# EAGLE design Pontos Cegos - Rev A (EAGLE 7.3.0)
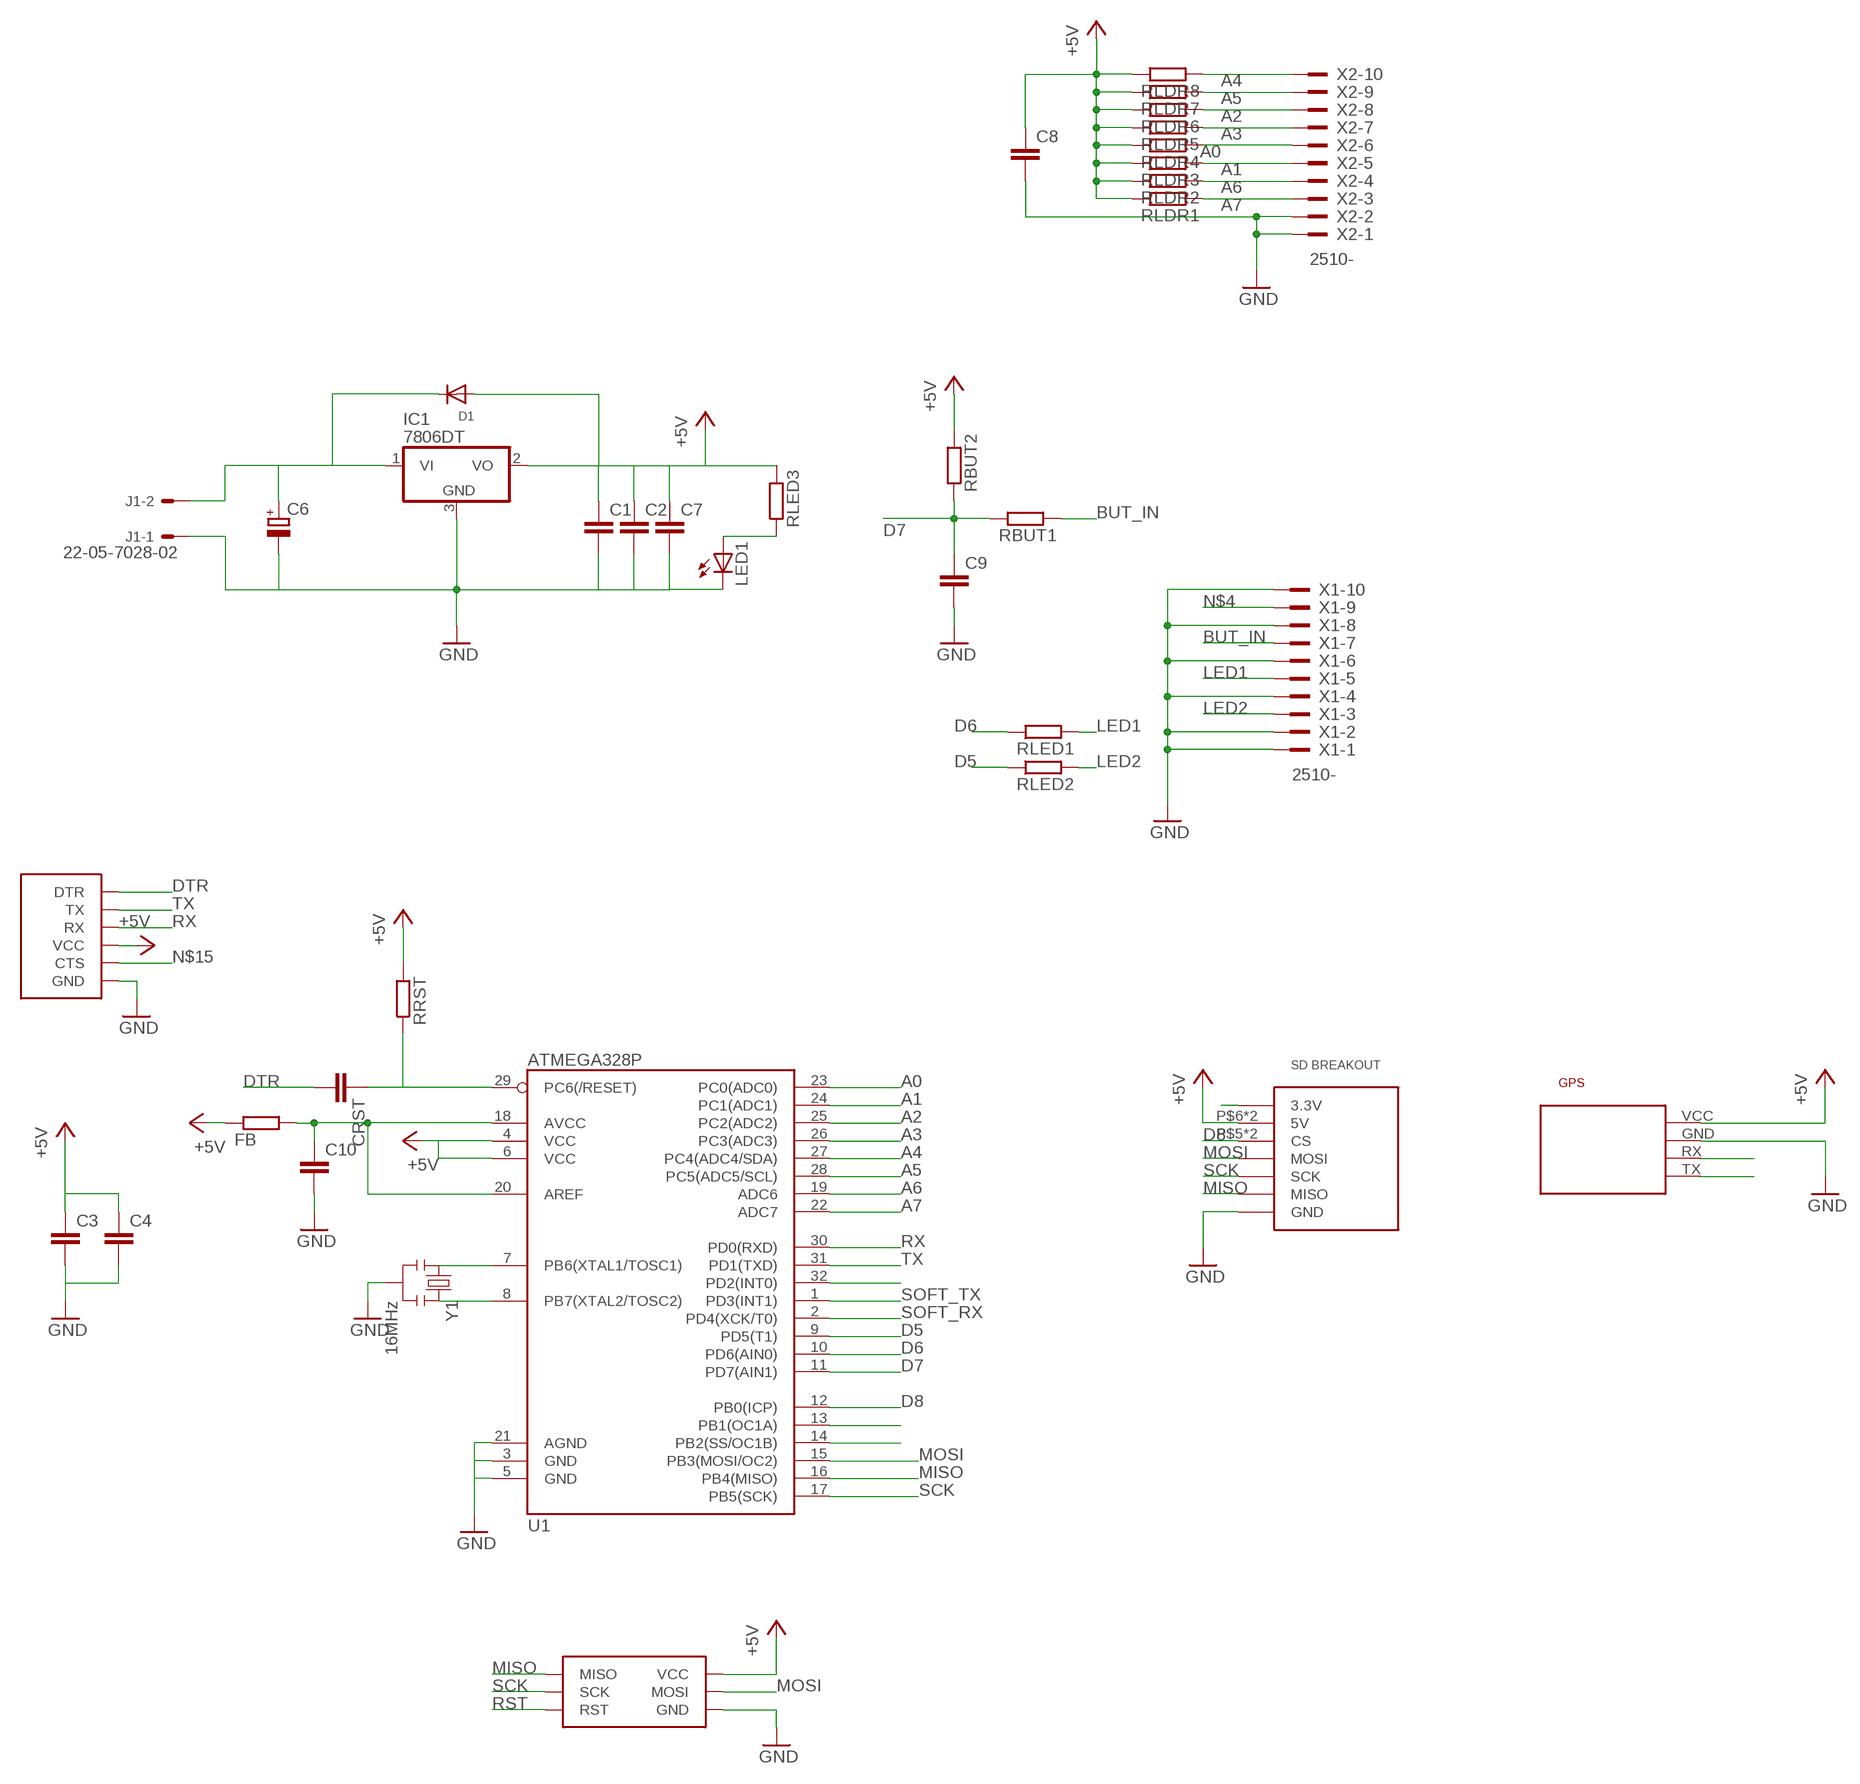
[diagram p0: schematic, sheet 1]

## Parts
C1  C-EUC1210  [C1210]
C2  C-EUC1210  [C1210]
C3  C-EUC0603  [C0603]
C4  C-EUC0603  [C0603]
C6  CPOL-EUD  [PANASONIC_D]
C7  C-EUC1210  [C1210]
C8  C-EUC0805  [C0805]
C9  C-EUC0805  [C0805]
C10  C-EUC0603  [C0603]
CRST  C-EUC0603  [C0603]
D1  DIODESMA  [SMADIODE]
FB  R-EU_R0603  [R0603]
IC1  7806DT  [TO252]
J1  22-05-7028-02  [7395-02]
LED1  LED5MM  [LED5MM]
RBUT1  R-EU_R0603  [R0603]
RBUT2  R-EU_R0603  [R0603]
RLDR1  R-EU_R0603  [R0603]
RLDR2  R-EU_R0603  [R0603]
RLDR3  R-EU_R0603  [R0603]
RLDR4  R-EU_R0603  [R0603]
RLDR5  R-EU_R0603  [R0603]
RLDR6  R-EU_R0603  [R0603]
RLDR7  R-EU_R0603  [R0603]
RLDR8  R-EU_R0603  [R0603]
RLED1  R-EU_R0603  [R0603]
RLED2  R-EU_R0603  [R0603]
RLED3  R-EU_R0603  [R0603]
RRST  R-EU_R0603  [R0603]
U1  ATMEGA328P  ATMEGA328_SMT  [TQFP32-08]
U$1  ISP_POGOISP_POGO  [ISP_POGO]
U$2  SD_BREAKOUT  [SD_BREAKOUT]
U$3  NEO6M_BREAKOUT  [NEO6M_BREAKOUT]
U$4  FTDI_HEADERSMD  [FTDI_HEADER_SMD]
X1  2510-  [PAK100/2500-10]
X2  2510-  [PAK100/2500-10]
Y1  16MHz  RESONATOR16MHZ  [RESONATOR-SMD]

## Nets
+5V: C1.1 C2.1 C3.1 C4.1 C7.1 C8.1 D1.A FB.1 IC1.2(VO) RBUT2.2 RLDR1.1 RLDR2.1 RLDR3.1 RLDR4.1 RLDR5.1 RLDR6.1 RLDR7.1 RLDR8.1 RLED3.2 RRST.2 U1.4(VCC) U1.6(VCC) U$1.VCC U$2.P$6(5V) U$2.P$14(5V) U$3.VCC U$4.VCC
A0: RLDR4.2 U1.23(PC0(ADC0)) X2.6
A1: RLDR3.2 U1.24(PC1(ADC1)) X2.5
A2: RLDR6.2 U1.25(PC2(ADC2)) X2.8
A3: RLDR5.2 U1.26(PC3(ADC3)) X2.7
A4: RLDR8.2 U1.27(PC4(ADC4/SDA)) X2.10
A5: RLDR7.2 U1.28(PC5(ADC5/SCL)) X2.9
A6: RLDR2.2 U1.19(ADC6) X2.4
A7: RLDR1.2 U1.22(ADC7) X2.3
BUT_IN: RBUT1.2 X1.7
D5: RLED2.1 U1.9(PD5(T1))
D6: RLED1.1 U1.10(PD6(AIN0))
D7: C9.1 RBUT1.1 RBUT2.1 U1.11(PD7(AIN1))
D8: U1.12(PB0(ICP)) U$2.P$5(CS) U$2.P$13(CS)
DTR: CRST.2 U$4.DTR
GND: C1.2 C2.2 C3.2 C4.2 C6.- C7.2 C8.2 C9.2 C10.2 IC1.3(GND) J1.1 LED1.K(C) U1.3(GND) U1.5(GND) U1.21(AGND) U$1.GND U$2.P$1(GND) U$2.P$8(GND) U$2.P$9(GND) U$2.P$16(GND) U$3.GND U$4.GND X1.1 X1.2 X1.4 X1.6 X1.8 X1.10 X2.1 X2.2 Y1.2
LED1: RLED1.2 X1.5
LED2: RLED2.2 X1.3
MISO: U1.16(PB4(MISO)) U$1.MISO U$2.P$2(MISO) U$2.P$10(MISO)
MOSI: U1.15(PB3(MOSI/OC2)) U$1.MOSI U$2.P$4(MOSI) U$2.P$12(MOSI)
N$1: U1.7(PB6(XTAL1/TOSC1)) Y1.1
N$2: U1.8(PB7(XTAL2/TOSC2)) Y1.3
N$3: LED1.A RLED3.1
N$4: X1.9
N$10: U1.32(PD2(INT0))
N$13: C6.+ D1.C IC1.1(VI) J1.2
N$15: U$4.CTS
N$19: U1.13(PB1(OC1A))
N$20: U1.14(PB2(SS/OC1B))
N$22: C10.1 FB.2 U1.18(AVCC) U1.20(AREF)
N$25: U$2.P$7(3.3V) U$2.P$15(3.3V)
RST: CRST.1 RRST.1 U1.29(PC6(/RESET)) U$1.RST
RX: U1.30(PD0(RXD)) U$4.RX
SCK: U1.17(PB5(SCK)) U$1.SCK U$2.P$3(SCK) U$2.P$11(SCK)
SOFT_RX: U1.2(PD4(XCK/T0)) U$3.TX
SOFT_TX: U1.1(PD3(INT1)) U$3.RX
TX: U1.31(PD1(TXD)) U$4.TX

## Library data of the parts
C1-C4 C7-C10 CRST = wes:C-EU: CAPACITOR, European symbol
C6 = rcl:CPOL-EU: POLARIZED CAPACITOR, European symbol
D1 = adafruit:DIODE: Diode SMADIODE - SMA Surface Mount Package 20V 1A Schottky Diode Digikey: 641-1014-6-ND DO-1N4148 - Through Hole Small Current Diode SOD-123 20V 1 A (.5mV Vf) Schottky Diode - Digikey: MBRX120TPMSCT-ND SOD-323 10V 570mA (.38mV Vf, 3ns) Schottky Diode - Digikey: ZLLS410CT-ND SOD-523 30V 30mA Schottky Diode (RB751S-40TE61) - Digikey: RB751S-40TE61CT-ND SOT23-R/W - SOT23 Package (R = Solder Paste/Reflow Ovens, W = Hand-Soldering) BAT54Film 40V 300mA - Digikey: 497-7162-1-ND
FB RBUT1 RBUT2 RLDR1-RLDR8 RLED1-RLED3 RRST = wes:R-EU_: RESISTOR, European symbol
IC1 = linear:78*: Positive VOLTAGE REGULATOR Source: http://cache.national.com/ds/LM/LM78L05.pdf http://www.fairchildsemi.com/ds/LM/LM7805.pdf
J1 = con-molex:22-?-02: CONNECTOR wire to board 2.54 mm (.1 inch) pitch header; OC_FARNELL: 9731601; OC_NEWARK: unknown
LED1 = adafruit:LED: LED OSRAM: - CHIPLED LG R971, LG N971, LY N971, LG Q971, LY Q971, LO R971, LY R971 LH N974, LH R974 LS Q976, LO Q976, LY Q976 LO Q996 - Hyper CHIPLED LW Q18S LB Q993, LB Q99A, LB R99A - SideLED LS A670, LO A670, LY A670, LG A670, LP A670 LB A673, LV A673, LT A673, LW A673 LH A674 LY A675 LS A676, LA A676, LO A676, LY A676, LW A676 LS A679, LY A679, LG A679 - Hyper Micro SIDELED® LS Y876, LA Y876, LO Y876, LY Y876 LT Y87S - SmartLED LW L88C, LW L88S LB L89C, LB L89S, LG L890 LS L89K, LO L89K, LY L89K LS L896, LA L896, LO L896, LY L896 - TOPLED LS T670, LO T670, LY T670, LG T670, LP T670 LSG T670, LSP T670, LSY T670, LOP T670, LYG T670 LG T671, LOG T671, LSG T671 LB T673, LV T673, LT T673, LW T673 LH T674 LS T676, LA T676, LO T676, LY T676, LB T676, LH T676, LSB T676, LW T676 LB T67C, LV T67C, LT T67C, LS T67K, LO T67K, LY T67K, LW E67C LS E67B, LA E67B, LO E67B, LY E67B, LB E67C, LV E67C, LT E67C LW T67C LS T679, LY T679, LG T679 LS T770, LO T770, LY T770, LG T770, LP T770 LB T773, LV T773, LT T773, LW T773 LH T774 LS E675, LA E675, LY E675, LS T675 LS T776, LA T776, LO T776, LY T776, LB T776 LHGB T686 LT T68C, LB T68C - Hyper Mini TOPLED® LB M676 - Mini TOPLED Santana® LG M470 LS M47K, LO M47K, LY M47K Source: http://www.osram.convergy.de/
U1 = SparkFun-DigitalIC:ATMEGA328_SMT: 32-Pin Atmega328 part Commonly used on Arduino compatible boards Available in QFP and QFN packages TQFP is IC-09069 QFN is non-stock; PROD_ID: IC-09069
U$1 = wes:ISP_POGO
U$2 = wes:SD_BREAKOUT
U$3 = wes:NEO6M_BREAKOUT
U$4 = wes:FTDI_HEADER
X1 X2 = con-3m:2510-: 3M (TM) Pak 100 4-Wall Header Source: 3M; MF: 3M; MPN: 2510-6002UB; OC_FARNELL: 9838244; OC_NEWARK: 46F4725
Y1 = SparkFun-FreqCtrl:RESONATOR: Resonator Small SMD resonator. Used, eg, on the Arduino Pro/ Pro Mini boards. 8MHz- XTAL-08895 16MHz- XTAL-08900; PROD_ID: XTAL-08900

## Board
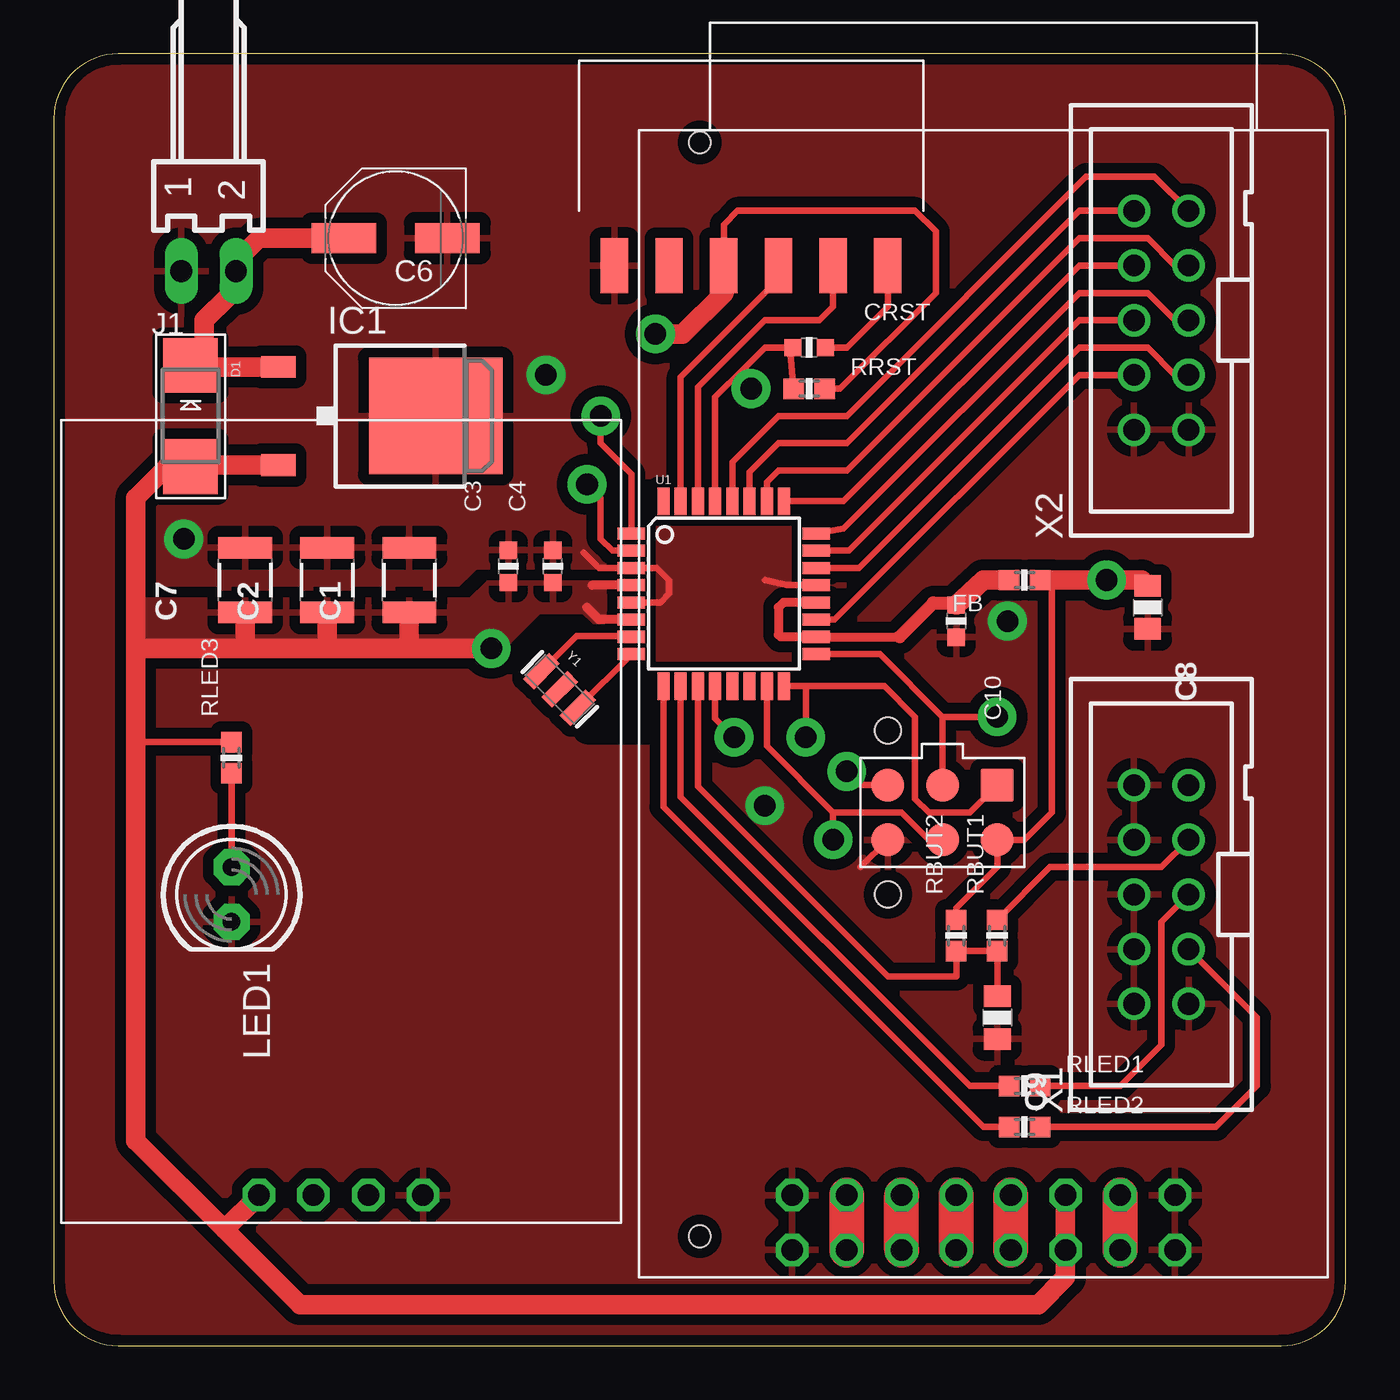
[diagram p1: board, top side]
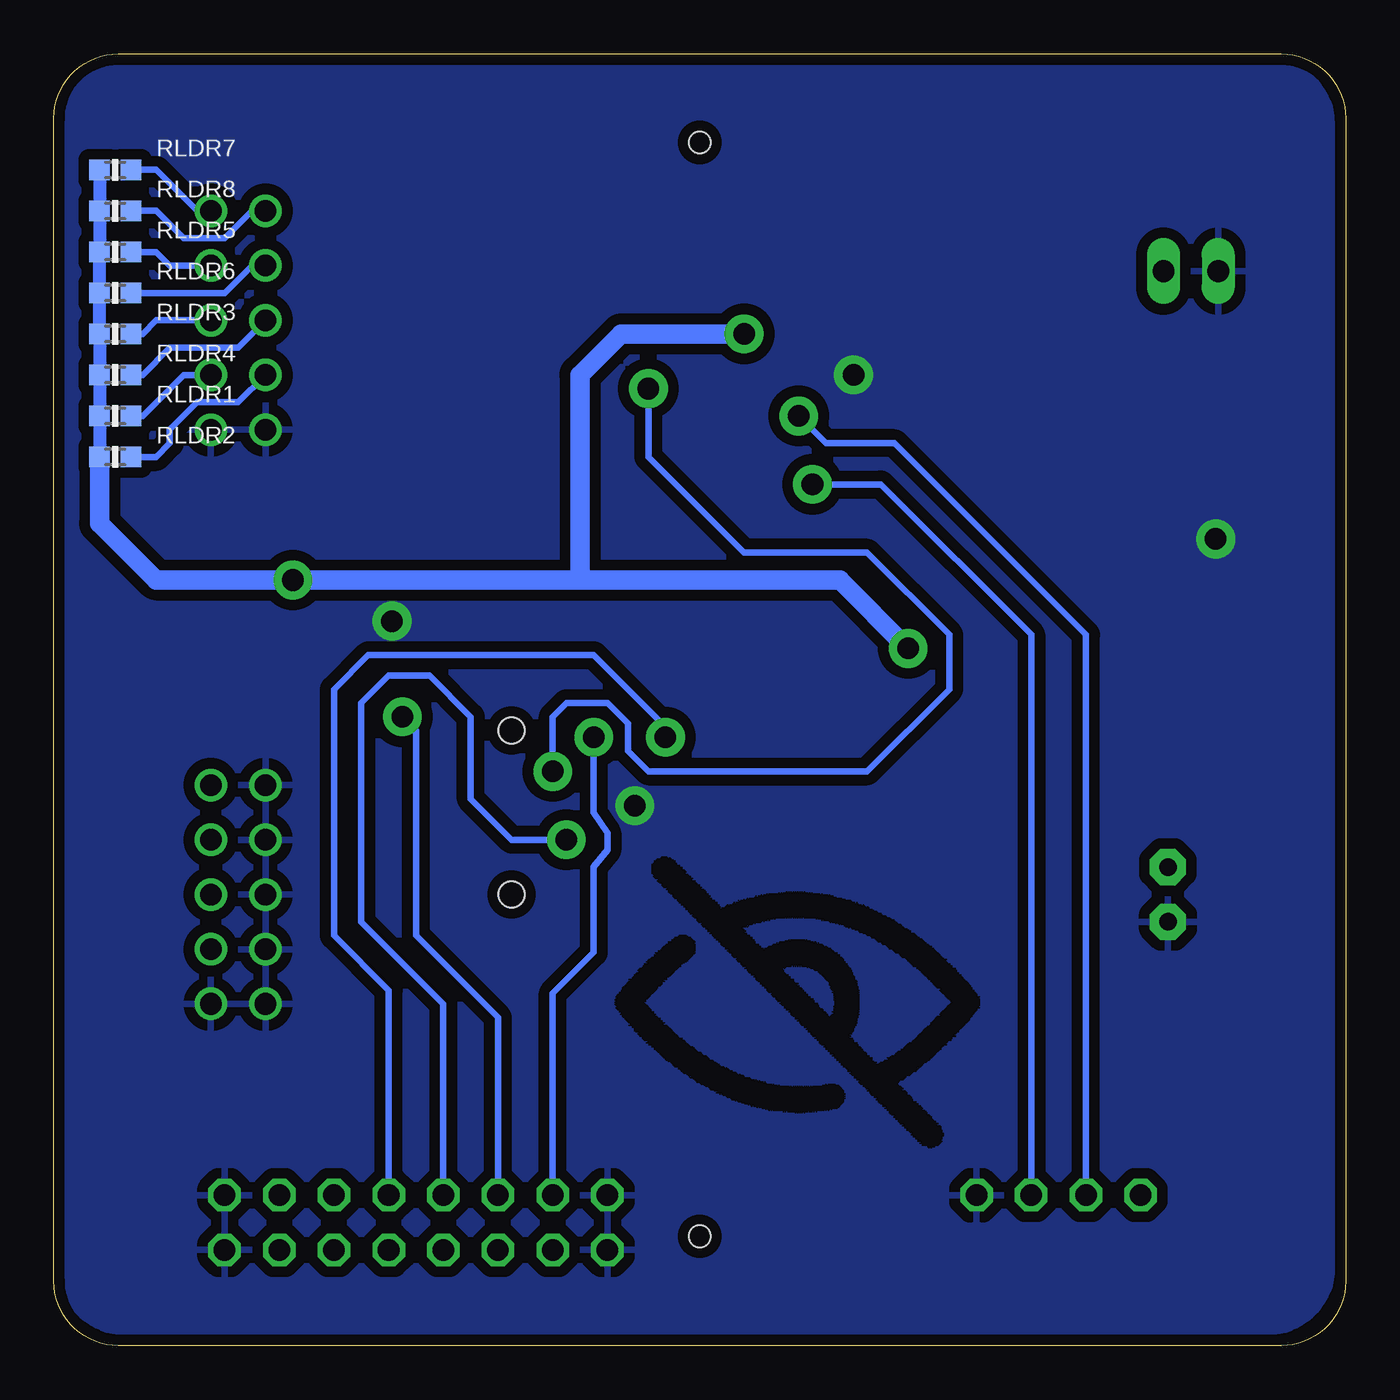
[diagram p2: board, bottom side, seen from below]

Size 60 x 60 mm. Coordinates in mm from the lower left corner, seen from the top.
Outline: 57,60 3,60 arc90 0,57 0,3 arc90 3,0 57,0 arc90 60,3 60,57 arc90 57,60
Copper layers (1*16): Top 0.035mm / dielectric 1.5mm / Bottom 0.035mm
Design rules "default *": minimum track width 10mil, minimum drill 0.6mm, track to track 8mil, track to pad 8mil, pad to pad 8mil, via to via 8mil, smd to smd 8mil, copper to edge 20mil, drill to drill 8mil, minimum pad ring 10mil, minimum via ring 8mil, stop-mask expansion 4mil, vias tented up to drill 0mil, thermal gap 20mil
Holes 1 mm at 30,55.88 30,5.08
tRestrict: 2 lines
bRestrict: area 19.2,9.2 to 19.3,9.2; area 19.3,9.2 to 19.4,9.2; area 19.1,9.2 to 19.4,9.3; area 18.9,9.3 to 19.7,9.3; area 18.9,9.3 to 19.7,9.4; area 18.8,9.4 to 19.8,9.4; area 18.8,9.4 to 19.7,9.5; area 18.7,9.5 to 19.9,9.5; area 18.8,9.5 to 19.9,9.6; area 18.7,9.6 to 20,9.6; area 18.7,9.6 to 20,9.7; area 18.7,9.7 to 20.1,9.7; 726 more areas

### Footprints (pad centres in the part's own frame; a part is rotated, then mirrored left to right if it is on the bottom)
C1210 = smd 1 x 2.5: 1 -1.5,0; 2 1.5,0
C0603 = smd 0.8 x 0.8: 1 -0.75,0; 2 0.75,0
PANASONIC_D = smd 3 x 1.4: + 2.4,0; - -2.4,0
C0805 = smd 1 x 1.25: 1 -1,0; 2 1,0
SMADIODE = smd 2.54 x 2.54: A 2.349,0; C -2.349,0
R0603 = smd 0.95 x 0.95: 1 -0.725,0; 2 0.725,0
TO252 = smd 1 x 1.6: 1 -2.28,-4.8; 2 2.28,-4.8 | smd 5.4 x 6.2: 3 0,2.5
7395-02 = drill 1.016 long: 1 1.27,0; 2 -1.27,0
LED5MM = drill 0.813 pad 1.676 octagon: A -1.27,0; K 1.27,0
TQFP32-08 = smd 1.27 x 0.559: 1 -4.293,2.8; 2 -4.293,2; 3 -4.293,1.2; 4 -4.293,0.4; 5 -4.293,-0.4; 6 -4.293,-1.2; 7 -4.293,-2; 8 -4.293,-2.8; 17 4.293,-2.8; 18 4.293,-2; 19 4.293,-1.2; 20 4.293,-0.4; 21 4.293,0.4; 22 4.293,1.2; 23 4.293,2; 24 4.293,2.8 | smd 0.559 x 1.27: 9 -2.8,-4.293; 10 -2,-4.293; 11 -1.2,-4.293; 12 -0.4,-4.293; 13 0.4,-4.293; 14 1.2,-4.293; 15 2,-4.293; 16 2.8,-4.293; 25 2.8,4.293; 26 2,4.293; 27 1.2,4.293; 28 0.4,4.293; 29 -0.4,4.293; 30 -1.2,4.293; 31 -2,4.293; 32 -2.8,4.293
ISP_POGO = smd 1.524 x 1.524: GND 1.27,-2.54; MISO -1.27,2.54; MOSI 1.27,0; RST -1.27,-2.54; SCK -1.27,0; VCC 1.27,2.54 | hole 1.2: -3.81,-2.54; 3.81,-2.54
SD_BREAKOUT = drill 1 octagon: P$1 -8.89,0; P$2 -6.35,0; P$3 -3.81,0; P$4 -1.27,0; P$5 1.27,0; P$6 3.81,0; P$7 6.35,0; P$8 8.89,0; P$9 -8.89,2.54; P$10 -6.35,2.54; P$11 -3.81,2.54; P$12 -1.27,2.54; P$13 1.27,2.54; P$14 3.81,2.54; P$15 6.35,2.54; P$16 8.89,2.54
NEO6M_BREAKOUT = drill 1 octagon: GND 3.81,0; RX -1.27,0; TX 1.27,0; VCC -3.81,0
FTDI_HEADER_SMD = smd 1.27 x 2.54: CTS -3.81,10.16; DTR 6.35,10.16; GND -6.35,10.16; RX 3.81,10.16; TX 1.27,10.16; VCC -1.27,10.16
PAK100/2500-10 = drill 1 pad 1.422: 1 -5.08,-1.27; 2 -5.08,1.27; 3 -2.54,-1.27; 4 -2.54,1.27; 5 0,-1.27; 6 0,1.27; 7 2.54,-1.27; 8 2.54,1.27; 9 5.08,-1.27; 10 5.08,1.27
RESONATOR-SMD = smd 0.7 x 1.7: 1 -1.2,0; 2 0,0; 3 1.2,0

### Placement (x,y rotation side)
C1  16.51,35.56 90 top
C2  12.7,35.56 90 top
C3  21.11,36.2 90 top
C4  23.18,36.2 90 top
C6  15.88,51.44 180 top
C7  8.89,35.56 90 top
C8  50.8,34.29 270 top
C9  43.81,15.24 270 top
C10  41.91,33.66 270 top
CRST  35.08,46.35 0 top
D1  6.35,43.18 270 top
FB  45.09,35.56 180 top
IC1  15.24,43.18 270 top
J1  7.19,49.91 180 top
LED1  8.26,20.95 270 top
RBUT1  43.81,19.05 90 top
RBUT2  41.91,19.05 90 top
RLDR1  57.15,43.18 0 bottom
RLDR2  57.15,41.27 0 bottom
RLDR3  57.15,46.99 0 bottom
RLDR4  57.15,45.09 0 bottom
RLDR5  57.15,50.8 0 bottom
RLDR6  57.15,48.9 0 bottom
RLDR7  57.15,54.61 0 bottom
RLDR8  57.15,52.7 0 bottom
RLED1  45.09,12.06 0 top
RLED2  45.09,10.16 0 top
RLED3  8.26,27.3 90 top
RRST  35.08,44.45 0 top
U1  31.11,34.92 0 top
U$1  41.27,24.77 270 top
U$2  43.18,4.45 0 top
U$3  13.34,6.99 0 top
U$4  32.38,40.01 0 top
X1  51.44,20.95 90 top
X2  51.44,47.62 90 top
Y1  23.5,30.48 315 top

### Tracks (layer width: path | path; a pad name or v marks a point on that pad's centre or on a via)
+5V  (via drill 1 pad 1.8)
  Top 0.305: U$2.P$6 U$2.P$14 | FB.1 46.35,35.56 46.35,24.77 45.09,23.5 U$1.VCC 43.81,22.23 41.91,20.32 RBUT2.2 | RRST.2 36.51,44.45 40.96,48.9 40.96,51.75 40.01,52.7 31.75,52.7 31.11,52.07 U$4.VCC 31.11,48.9 | RLED3.2 3.9,28.03 3.81,27.94
  Top 0.406: U1.4 25.01,35.33 | U1.6 25.33,33.73 24.77,34.29
  Top 0.61: 6.42,40.9 D1.A
  Top 0.914: U$2.P$14 46.99,3.17 45.72,1.91 11.43,1.91 7.94,5.4 | 7.94,5.4 3.81,9.53 3.81,27.94 3.81,32.38 | 46.35,35.56 v48.9,35.56 50.53,35.56 C8.1 | v20.32,32.38 16.51,32.38 | 16.51,32.38 12.7,32.38 | 12.7,32.38 8.89,32.38 | 8.89,32.38 3.81,32.38 | IC1.2 6.42,40.9 | D1.A 5.27,40.83 3.81,39.37 3.81,32.38 | U$3.VCC 7.94,5.4 | C1.1 16.51,32.38 | C2.1 12.7,32.38 | C7.1 8.89,32.38 | 31.11,48.9 29.21,46.99 v27.94,46.99
  Bottom 0.61: RLDR7.1 RLDR8.1 RLDR5.1 RLDR6.1 RLDR3.1 RLDR4.1 RLDR1.1 RLDR2.1
  Bottom 0.914: 35.56,35.56 v48.9,35.56 55.24,35.56 57.88,38.19 RLDR2.1 | 35.56,35.56 23.5,35.56 v20.32,32.38 | v27.94,46.99 33.66,46.99 35.56,45.09 35.56,35.56
  pour Top: 25.56,35.4 20.16,35.4 19.37,34.61 3.97,34.61 3.97,32.38 20.8,32.38 22.54,34.13 24.61,34.13 25.08,33.66 25.56,33.66
A0
  Top 0.305: X2.6 47.62,47.62 36.92,36.92 U1.23
  Bottom 0.305: RLDR4.2 55.88,45.09 54.61,46.35 51.44,46.35 X2.6
A1
  Top 0.305: X2.5 52.07,47.62 50.8,48.9 47.62,48.9 36.68,37.95 U1.24
  Bottom 0.305: RLDR3.2 55.88,46.99 55.24,47.62 X2.5
A2
  Top 0.305: X2.8 47.62,50.16 36.68,39.22 U1.25
  Bottom 0.305: RLDR6.2 52.07,48.9 50.8,50.16 X2.8
A3
  Top 0.305: X2.7 52.07,50.16 50.8,51.44 47.62,51.44 36.83,40.64 33.66,40.64 33.12,40.1 U1.26
  Bottom 0.305: RLDR5.2 55.24,50.8 54.61,50.16 X2.7
A4
  Top 0.305: X2.10 47.62,52.7 36.83,41.91 33.66,41.91 32.31,40.57 U1.27
  Bottom 0.305: RLDR8.2 55.24,52.7 53.98,51.44 52.07,51.44 50.8,52.7 X2.10
A5
  Top 0.305: X2.9 51.12,54.29 47.94,54.29 36.83,43.18 33.66,43.18 31.52,41.04 U1.28
  Bottom 0.305: RLDR7.2 55.24,54.61 53.34,52.7 X2.9
A6
  Top 0.305: X2.4 47.62,45.09 36.27,33.73 U1.19
  Bottom 0.305: X2.4 51.44,43.81 53.34,43.81 54.61,42.55 54.61,41.91 55.24,41.27 RLDR2.2
A7
  Top 0.305: X2.3 52.07,45.09 50.8,46.35 47.62,46.35 37.4,36.12 U1.22
  Bottom 0.305: RLDR1.2 55.88,43.18 53.98,45.09 X2.3
BUT_IN
  Top 0.305: X1.7 51.44,22.23 46.27,22.23 RBUT1.2
D5
  Top 0.305: U1.9 28.32,25.02 43.18,10.16 RLED2.1
D6
  Top 0.305: U1.10 29.11,25.5 42.55,12.06 RLED1.1
D7
  Top 0.305: U1.11 29.91,25.96 38.73,17.14 41.91,17.14 RBUT2.1 RBUT1.1 C9.1
D8  (via drill 1 pad 1.8)
  Top 0.305: U1.12 30.71,29.13 v31.59,28.26
  Top 1.626: U$2.P$5 U$2.P$13
  Bottom 0.305: U$2.P$13 44.45,16.51 46.99,19.05 46.99,30.48 45.4,32.07 34.92,32.07 31.59,28.73 v31.59,28.26
DTR
  Top 0.305: U$4.DTR 38.73,48.26 36.83,46.35 CRST.2
GND  (via drill 1 pad 1.8)
  Top 0.305: U1.5 28.18,34.52 28.57,34.92 28.57,35.56 28.01,36.12 U1.3 25.31,36.12 24.61,36.83 | U1.21 34.05,35.33 33.02,35.56 | U$1.GND 37.47,22.23
  other vias: 33.02,25.08 44.29,33.66 6.03,37.47 22.86,45.09
  pour Bottom (isolate 0.5, rank 2): 56.69,0.64 3.63,0.64 arc-90 0.64,3.63 0.64,56.69 arc-90 3.63,59.69 56.69,59.69 arc-90 59.69,56.69 59.69,3.63 arc-90
  pour Top (isolate 0.5, rank 2): -19.68,67.94 92.08,67.94 92.08,-5.71 -19.68,-5.71
  pour Bottom (no thermals): 16.76,23.83 31.75,23.83 33.12,22.45 33.12,17.98 34.9,16.21 34.9,13.97 30.28,9.35 21.89,9.35 20.57,8.03 19.3,8.03 17.73,9.6 17.73,12.9 16.15,14.48 16.15,23.22
LED1
  Top 0.305: RLED1.2 49.53,12.06 51.44,13.97 51.44,19.68 X1.5
LED2
  Top 0.305: RLED2.2 53.98,10.16 55.88,12.06 55.88,15.24 X1.3
MISO  (via drill 1 pad 1.8)
  Top 0.305: U1.16 34.92,30.63 | 34.92,30.63 38.58,30.63 40.01,29.21 40.01,25.4 40.64,24.77 42.55,24.77 U$1.MISO | v34.92,28.26 34.92,30.63
  Top 1.626: U$2.P$2 U$2.P$10
  Bottom 0.305: U$2.P$10 36.83,16.35 34.92,18.26 34.92,22.23 34.29,23.02 34.29,23.81 34.92,24.77 v34.92,28.26
MOSI  (via drill 1 pad 1.8)
  Top 0.305: U1.15 33.12,27.84 36.2,24.77 | 36.2,24.77 39.37,24.77 40.64,23.5 U$1.MOSI | v36.2,23.5 36.2,24.77
  Top 1.626: U$2.P$4 U$2.P$12
  Bottom 0.305: v36.2,23.5 38.73,23.5 40.64,25.4 40.64,29.21 42.55,31.11 44.45,31.11 45.72,29.84 45.72,19.68 41.91,15.88 U$2.P$12
N$1
  Top 0.305: U1.7 26.8,32.95 24.27,32.95 Y1.1
N$2
  Top 0.305: U1.8 Y1.3
N$3
  Top 0.305: LED1.A RLED3.1
N$13
  Top 0.305: 8.12,48.76 8.26,48.9
  Top 0.914: IC1.1 6.99,45.46 | 6.99,45.46 6.42,45.46 D1.C | 8.12,48.76 6.99,47.62 6.99,45.46 | C6.+ 9.53,51.44 8.46,50.37 J1.2 8.46,49.1 8.26,48.9
N$22
  Top 0.305: 33.75,32.92 33.66,33.02 | 41.82,34.5 C10.1
  Top 0.406: U1.20 33.89,34.52 33.66,34.29 33.66,33.02 | 33.75,32.92 U1.18 39.27,32.92
  Top 0.61: 39.27,32.92 40.85,34.5 41.82,34.5
  Top 0.914: FB.2 43.18,35.56 C10.1
N$25
  Top 1.626: U$2.P$7 U$2.P$15
RST  (via drill 1 pad 1.8)
  Top 0.305: U1.29 30.71,44.05 32.07,45.4 | 32.07,45.4 33.02,46.35 CRST.1 34.2,46.33 RRST.1 | U$1.RST 37.47,26.04 v36.83,26.67 | v32.38,44.45 32.38,45.09 32.07,45.4
  Bottom 0.305: v36.83,26.67 36.83,29.21 36.2,29.84 34.29,29.84 33.34,28.89 33.34,27.62 32.38,26.67 22.23,26.67 18.41,30.48 18.41,33.02 22.23,36.83 27.94,36.83 32.38,41.27 v32.38,44.45
RX
  Top 0.305: U$4.RX 36.2,48.26 35.56,47.62 33.02,47.62 29.91,44.52 U1.30
SCK  (via drill 1 pad 1.8)
  Top 0.305: U$1.SCK 41.27,29.21 | 41.27,29.21 38.36,32.12 U1.17 | v43.81,29.21 41.27,29.21
  Top 1.626: U$2.P$3 U$2.P$11
  Bottom 0.305: U$2.P$11 39.37,15.24 43.18,19.05 43.18,28.57 v43.81,29.21
SOFT_RX  (via drill 1 pad 1.8)
  Top 0.305: U1.2 25.94,36.92 25.4,37.47 25.4,39.37 v24.77,40.01
  Bottom 0.305: v24.77,40.01 21.59,40.01 14.61,33.02 U$3.TX
SOFT_TX  (via drill 1 pad 1.8)
  Top 0.305: U1.1 26.82,40.49 25.4,41.91 v25.4,43.18
  Bottom 0.305: U$3.RX 12.06,33.02 20.95,41.91 24.13,41.91 v25.4,43.18
TX
  Top 0.305: U$4.TX 33.66,49.53 29.11,44.99 U1.31